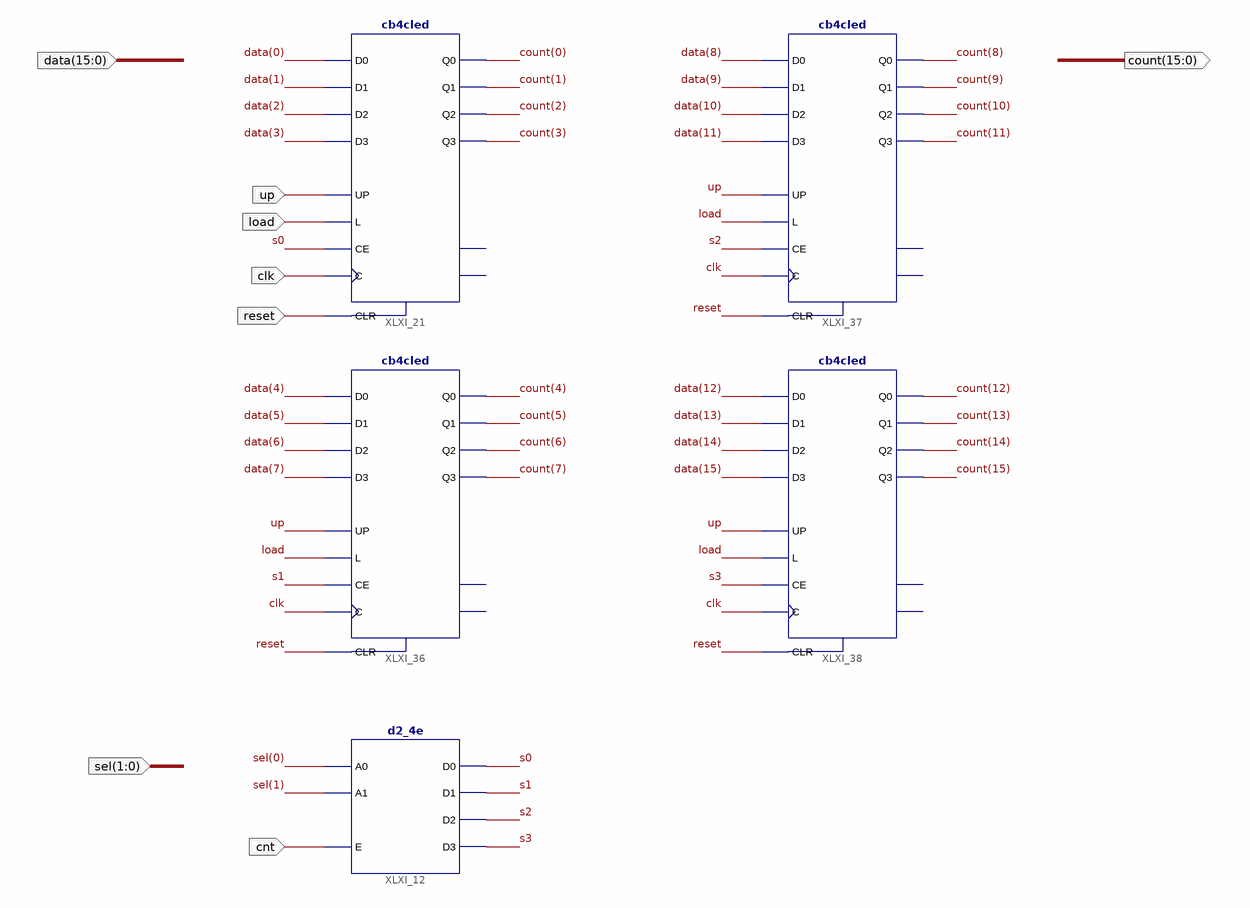
[diagram p0: schematic sheet 1]
// Xilinx ISE schematic hex4.sch (spartan3e) as structural Verilog: 5 symbols, 8 ports
module hex4 (
  input  up,
  input  reset,
  input  clk,
  input  load,
  input  [15:0] data,
  input  cnt,
  input  [1:0] sel,
  output [15:0] count
);

  wire s0, s1, s2, s3;

  cb4cled XLXI_21 (
    .C(clk), .CE(s0), .CLR(reset), .D0(data[0]), .D1(data[1]), .D2(data[2]), .D3(data[3]), .L(load), .UP(up),
    .Q0(count[0]), .Q1(count[1]), .Q2(count[2]), .Q3(count[3]));  // open: CEO, TC
  cb4cled XLXI_36 (
    .C(clk), .CE(s1), .CLR(reset), .D0(data[4]), .D1(data[5]), .D2(data[6]), .D3(data[7]), .L(load), .UP(up),
    .Q0(count[4]), .Q1(count[5]), .Q2(count[6]), .Q3(count[7]));  // open: CEO, TC
  cb4cled XLXI_37 (
    .C(clk), .CE(s2), .CLR(reset), .D0(data[8]), .D1(data[9]), .D2(data[10]), .D3(data[11]), .L(load),
    .UP(up), .Q0(count[8]), .Q1(count[9]), .Q2(count[10]), .Q3(count[11]));  // open: CEO, TC
  cb4cled XLXI_38 (
    .C(clk), .CE(s3), .CLR(reset), .D0(data[12]), .D1(data[13]), .D2(data[14]), .D3(data[15]), .L(load),
    .UP(up), .Q0(count[12]), .Q1(count[13]), .Q2(count[14]), .Q3(count[15]));  // open: CEO, TC
  d2_4e XLXI_12 (.A0(sel[0]), .A1(sel[1]), .E(cnt), .D0(s0), .D1(s1), .D2(s2), .D3(s3));
endmodule
